# Altium schematic sheet Temperature_sensor.SchDoc: Temperature_sensor
size A4; DocumentNumber: 1; Revision: 1; SheetNumber: 1; SheetTotal: 5
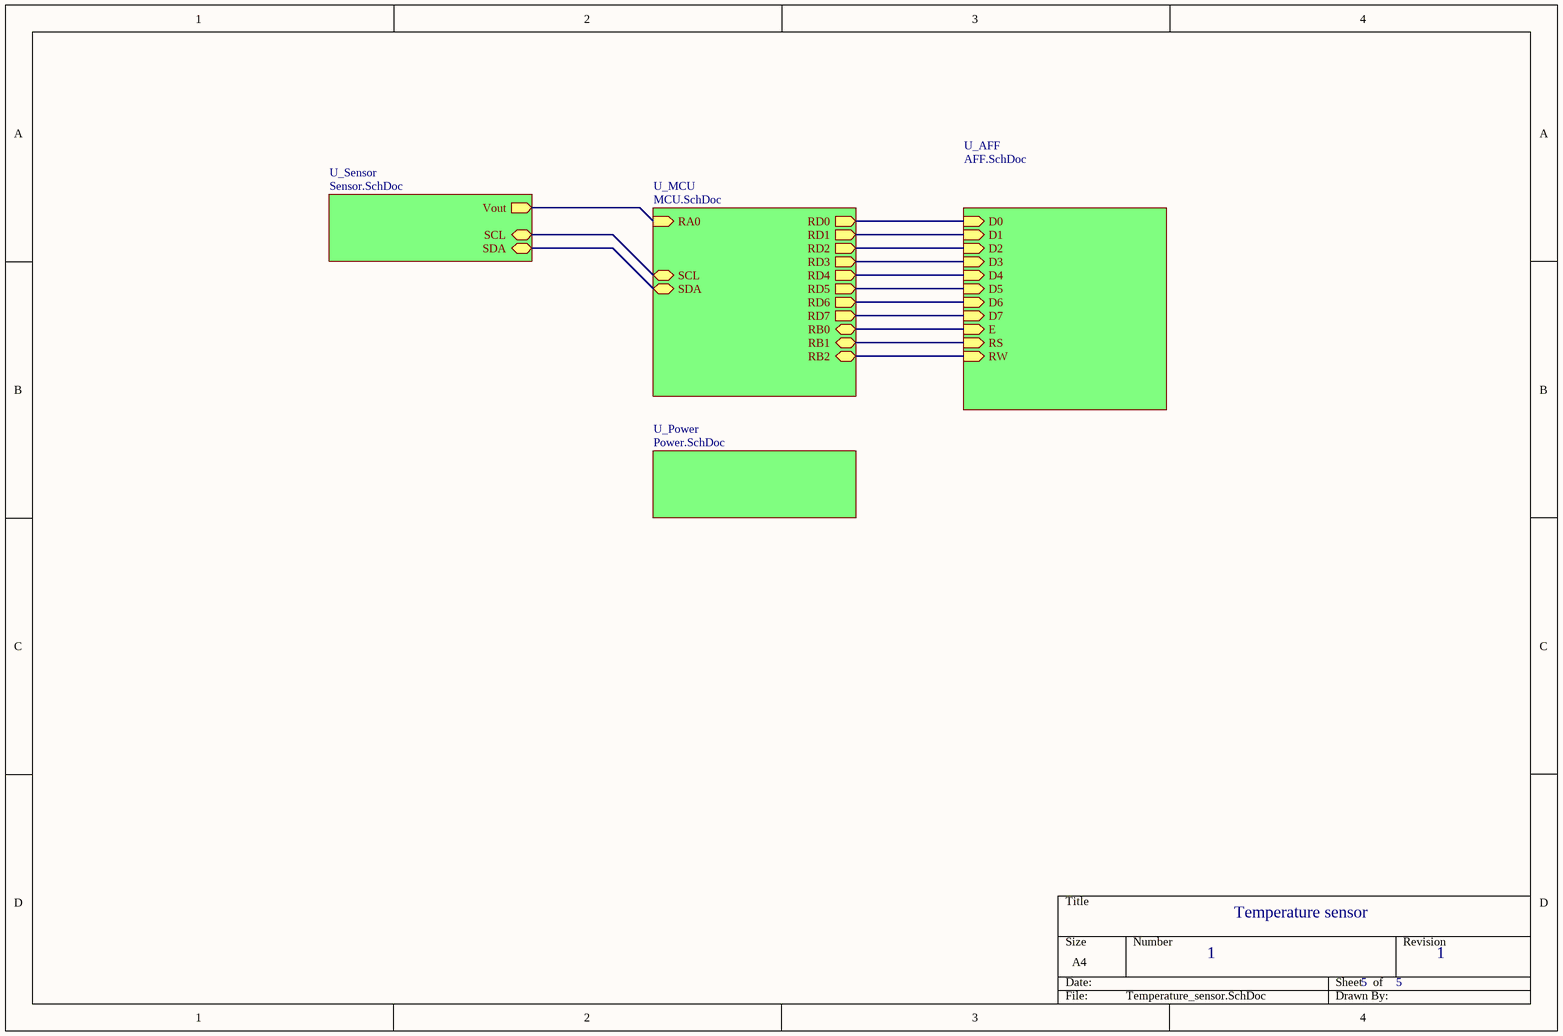
[diagram p0: Temperature_sensor.SchDoc]

## Sub-sheets
U_AFF = AFF.SchDoc: RS (in), RW (in), E (in), D0 (in), D1 (in), D2 (in), D3 (in), D4 (in), D5 (in), D6 (in), D7 (in)
U_MCU = MCU.SchDoc: RA0 (in), RB0 (bidir), RB1 (bidir), RB2 (bidir), SCL (bidir), SDA (bidir), RD0 (out), RD1 (out), RD2 (out), RD3 (out), RD4 (out), RD5 (out), RD6 (out), RD7 (out)
U_Power = Power.SchDoc: no entries
U_Sensor = Sensor.SchDoc: Vout (out), SDA (bidir), SCL (bidir)

## Nets
(unnamed): sheet U_Sensor/Vout, sheet U_MCU/RA0
(unnamed): sheet U_Sensor/SDA, sheet U_MCU/SDA
(unnamed): sheet U_Sensor/SCL, sheet U_MCU/SCL
(unnamed): sheet U_MCU/RB0, sheet U_AFF/E
(unnamed): sheet U_MCU/RB1, sheet U_AFF/RS
(unnamed): sheet U_MCU/RB2, sheet U_AFF/RW
(unnamed): sheet U_MCU/RD0, sheet U_AFF/D0
(unnamed): sheet U_MCU/RD1, sheet U_AFF/D1
(unnamed): sheet U_MCU/RD2, sheet U_AFF/D2
(unnamed): sheet U_MCU/RD3, sheet U_AFF/D3
(unnamed): sheet U_MCU/RD4, sheet U_AFF/D4
(unnamed): sheet U_MCU/RD5, sheet U_AFF/D5
(unnamed): sheet U_MCU/RD6, sheet U_AFF/D6
(unnamed): sheet U_MCU/RD7, sheet U_AFF/D7

## Notes on the sheet
- Temperature sensor
- 1
- 5